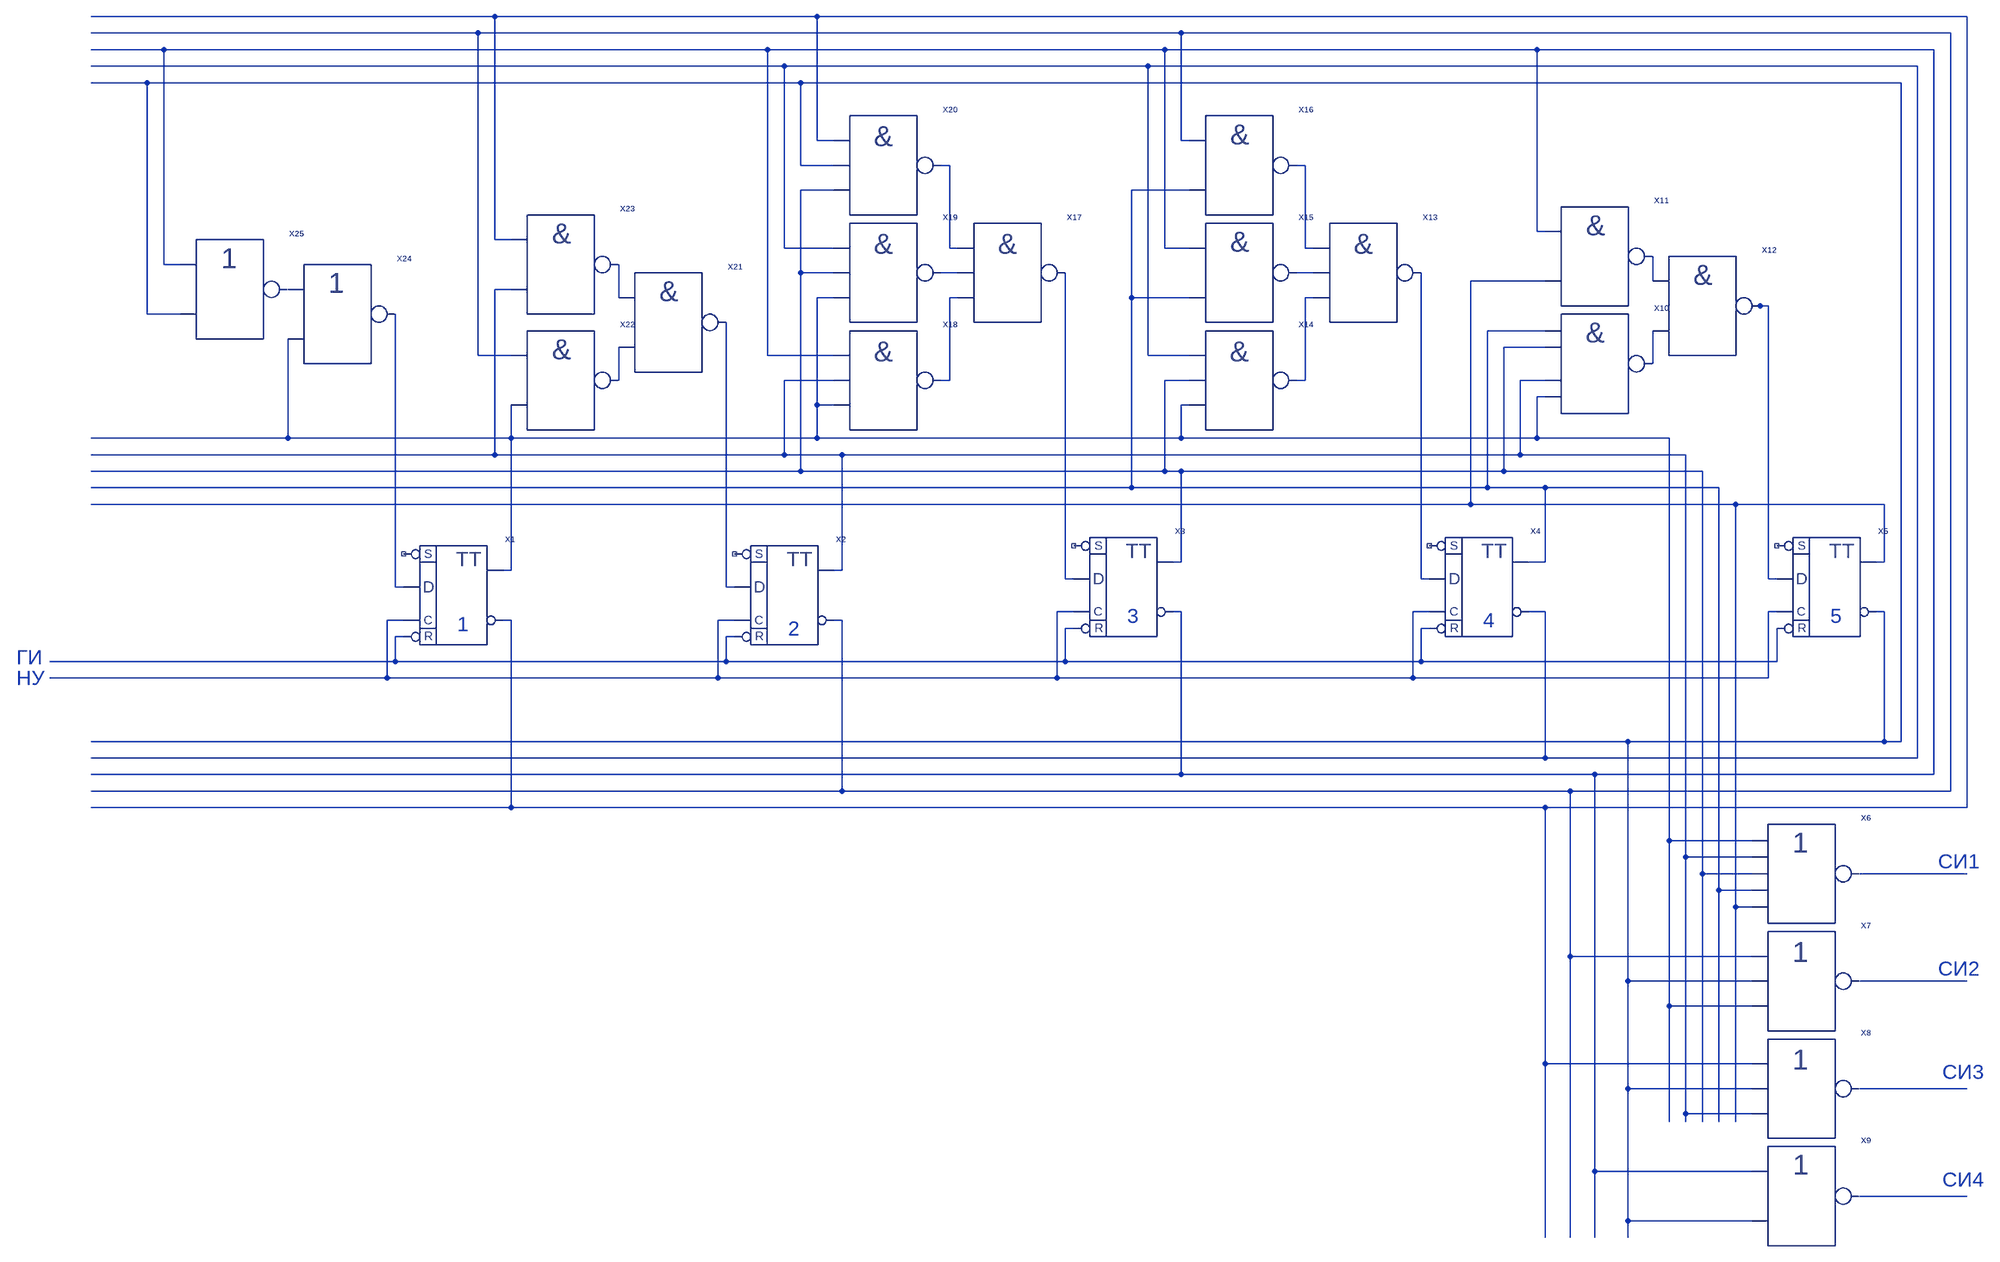
[diagram p0: schematic CounterN.asc]
CounterN.asc, the LTspice schematic file:
Version 4
SHEET 1 2772 1684
WIRE -272 -704 -1056 -704
WIRE 352 -704 -272 -704
WIRE 2576 -704 352 -704
WIRE -304 -672 -1056 -672
WIRE 1056 -672 -304 -672
WIRE 2544 -672 1056 -672
WIRE -912 -640 -1056 -640
WIRE 256 -640 -912 -640
WIRE 1024 -640 256 -640
WIRE 1744 -640 1024 -640
WIRE 2512 -640 1744 -640
WIRE 288 -608 -1056 -608
WIRE 992 -608 288 -608
WIRE 2480 -608 992 -608
WIRE -944 -576 -1056 -576
WIRE 320 -576 -944 -576
WIRE 2448 -576 320 -576
WIRE 352 -464 352 -704
WIRE 384 -464 352 -464
WIRE 1056 -464 1056 -672
WIRE 1072 -464 1056 -464
WIRE 320 -416 320 -576
WIRE 384 -416 320 -416
WIRE 608 -416 592 -416
WIRE 1296 -416 1280 -416
WIRE 384 -368 320 -368
WIRE 1072 -368 960 -368
WIRE 1744 -288 1744 -640
WIRE 1760 -288 1744 -288
WIRE -272 -272 -272 -704
WIRE -240 -272 -272 -272
WIRE 288 -256 288 -608
WIRE 384 -256 288 -256
WIRE 608 -256 608 -416
WIRE 624 -256 608 -256
WIRE 1024 -256 1024 -640
WIRE 1072 -256 1024 -256
WIRE 1296 -256 1296 -416
WIRE 1312 -256 1296 -256
WIRE -912 -224 -912 -640
WIRE -880 -224 -912 -224
WIRE 320 -208 320 -368
WIRE 384 -208 320 -208
WIRE 624 -208 592 -208
WIRE 1312 -208 1280 -208
WIRE 1760 -192 1616 -192
WIRE 1968 -192 1968 -240
WIRE -240 -176 -272 -176
WIRE -32 -160 -32 -224
WIRE 384 -160 352 -160
WIRE 624 -160 608 -160
WIRE 960 -160 960 -368
WIRE 1072 -160 960 -160
WIRE 1312 -160 1296 -160
WIRE 2176 -144 2160 -144
WIRE 2192 -144 2176 -144
WIRE -944 -128 -944 -576
WIRE -880 -128 -944 -128
WIRE 1760 -96 1648 -96
WIRE 1760 -64 1680 -64
WIRE -304 -48 -304 -672
WIRE -240 -48 -304 -48
WIRE 256 -48 256 -640
WIRE 384 -48 256 -48
WIRE 992 -48 992 -608
WIRE 1072 -48 992 -48
WIRE 1968 -32 1968 -96
WIRE -32 0 -32 -64
WIRE 384 0 288 0
WIRE 608 0 608 -160
WIRE 608 0 592 0
WIRE 1072 0 1024 0
WIRE 1296 0 1296 -160
WIRE 1296 0 1280 0
WIRE 1760 0 1712 0
WIRE 1760 32 1744 32
WIRE 352 48 352 -160
WIRE 384 48 352 48
WIRE 1072 48 1056 48
WIRE -672 112 -672 -80
WIRE -672 112 -1056 112
WIRE -240 112 -240 48
WIRE -240 112 -672 112
WIRE 352 112 352 48
WIRE 352 112 -240 112
WIRE 1056 112 1056 48
WIRE 1056 112 352 112
WIRE 1744 112 1744 32
WIRE 1744 112 1056 112
WIRE 2000 112 1744 112
WIRE -272 144 -272 -176
WIRE -272 144 -1056 144
WIRE 288 144 288 0
WIRE 288 144 -272 144
WIRE 400 144 288 144
WIRE 1712 144 1712 0
WIRE 1712 144 400 144
WIRE 2032 144 1712 144
WIRE 320 176 320 -208
WIRE 320 176 -1056 176
WIRE 1024 176 1024 0
WIRE 1024 176 320 176
WIRE 1056 176 1024 176
WIRE 1680 176 1680 -64
WIRE 1680 176 1056 176
WIRE 2064 176 1680 176
WIRE 960 208 960 -160
WIRE 960 208 -1056 208
WIRE 1648 208 1648 -96
WIRE 1648 208 960 208
WIRE 1760 208 1648 208
WIRE 2096 208 1760 208
WIRE 1616 240 1616 -192
WIRE 1616 240 -1056 240
WIRE 2128 240 1616 240
WIRE 2416 240 2128 240
WIRE 1056 352 1056 176
WIRE 1056 352 1040 352
WIRE 1760 352 1760 208
WIRE 1760 352 1728 352
WIRE 2416 352 2416 240
WIRE 2416 352 2400 352
WIRE -240 368 -240 112
WIRE -240 368 -256 368
WIRE 400 368 400 144
WIRE 400 368 384 368
WIRE 832 384 832 -208
WIRE 848 384 832 384
WIRE 1520 384 1520 -208
WIRE 1536 384 1520 384
WIRE 2192 384 2192 -144
WIRE 2208 384 2192 384
WIRE -464 400 -464 -128
WIRE -448 400 -464 400
WIRE 176 400 176 -112
WIRE 192 400 176 400
WIRE 848 448 816 448
WIRE 1056 448 1040 448
WIRE 1536 448 1504 448
WIRE 1760 448 1728 448
WIRE 2208 448 2192 448
WIRE 2416 448 2400 448
WIRE -448 464 -480 464
WIRE -240 464 -256 464
WIRE 192 464 160 464
WIRE 400 464 384 464
WIRE 848 480 832 480
WIRE 1536 480 1520 480
WIRE -448 496 -464 496
WIRE 192 496 176 496
WIRE -464 544 -464 496
WIRE -464 544 -1136 544
WIRE 176 544 176 496
WIRE 176 544 -464 544
WIRE 832 544 832 480
WIRE 832 544 176 544
WIRE 1520 544 1520 480
WIRE 1520 544 832 544
WIRE 2208 544 2208 480
WIRE 2208 544 1520 544
WIRE -480 576 -480 464
WIRE -480 576 -1136 576
WIRE 160 576 160 464
WIRE 160 576 -480 576
WIRE 816 576 816 448
WIRE 816 576 160 576
WIRE 1504 576 1504 448
WIRE 1504 576 816 576
WIRE 2192 576 2192 448
WIRE 2192 576 1504 576
WIRE 1920 704 -1056 704
WIRE 2416 704 2416 448
WIRE 2416 704 1920 704
WIRE 2448 704 2448 -576
WIRE 2448 704 2416 704
WIRE 1760 736 1760 448
WIRE 1760 736 -1056 736
WIRE 2480 736 2480 -608
WIRE 2480 736 1760 736
WIRE 1056 768 1056 448
WIRE 1056 768 -1056 768
WIRE 1856 768 1056 768
WIRE 2512 768 2512 -640
WIRE 2512 768 1856 768
WIRE 400 800 400 464
WIRE 400 800 -1056 800
WIRE 1808 800 400 800
WIRE 2544 800 2544 -672
WIRE 2544 800 1808 800
WIRE -240 832 -240 464
WIRE -240 832 -1056 832
WIRE 1760 832 -240 832
WIRE 2576 832 2576 -704
WIRE 2576 832 1760 832
WIRE 2000 896 2000 112
WIRE 2160 896 2000 896
WIRE 2032 928 2032 144
WIRE 2160 928 2032 928
WIRE 2064 960 2064 176
WIRE 2160 960 2064 960
WIRE 2576 960 2368 960
WIRE 2096 992 2096 208
WIRE 2160 992 2096 992
WIRE 2128 1024 2128 240
WIRE 2160 1024 2128 1024
WIRE 1808 1120 1808 800
WIRE 2160 1120 1808 1120
WIRE 1920 1168 1920 704
WIRE 2160 1168 1920 1168
WIRE 2576 1168 2368 1168
WIRE 2000 1216 2000 896
WIRE 2160 1216 2000 1216
WIRE 1760 1328 1760 832
WIRE 2160 1328 1760 1328
WIRE 1920 1376 1920 1168
WIRE 2160 1376 1920 1376
WIRE 2576 1376 2368 1376
WIRE 2032 1424 2032 928
WIRE 2160 1424 2032 1424
WIRE 2000 1440 2000 1216
WIRE 2032 1440 2032 1424
WIRE 2064 1440 2064 960
WIRE 2096 1440 2096 992
WIRE 2128 1440 2128 1024
WIRE 1856 1536 1856 768
WIRE 2160 1536 1856 1536
WIRE 2576 1584 2368 1584
WIRE 1920 1632 1920 1376
WIRE 2160 1632 1920 1632
WIRE 1760 1664 1760 1328
WIRE 1808 1664 1808 1120
WIRE 1856 1664 1856 1536
WIRE 1920 1664 1920 1632
SYMBOL D -352 416 R0
SYMATTR InstName X1
SYMBOL D 288 416 R0
SYMATTR InstName X2
SYMBOL D 944 400 R0
SYMATTR InstName X3
SYMBOL D 1632 400 R0
SYMATTR InstName X4
SYMBOL D 2304 400 R0
SYMATTR InstName X5
SYMBOL NOR5 2256 960 R0
SYMATTR InstName X6
SYMBOL NOR3 2256 1168 R0
SYMATTR InstName X7
SYMBOL NOR3 2256 1376 R0
SYMATTR InstName X8
SYMBOL NOR2 2256 1584 R0
SYMATTR InstName X9
SYMBOL NAND4 1856 -32 R0
SYMATTR InstName X10
SYMBOL NAND2 1856 -240 R0
SYMATTR InstName X11
SYMBOL NAND2 2064 -144 R0
SYMATTR InstName X12
SYMBOL NAND3 1408 -208 R0
SYMATTR InstName X13
SYMBOL NAND3 1168 0 R0
SYMATTR InstName X14
SYMBOL NAND2 1168 -208 R0
SYMATTR InstName X15
SYMBOL NAND2 1168 -416 R0
SYMATTR InstName X16
SYMBOL NAND3 720 -208 R0
SYMATTR InstName X17
SYMBOL NAND3 480 0 R0
SYMATTR InstName X18
SYMBOL NAND3 480 -208 R0
SYMATTR InstName X19
SYMBOL NAND3 480 -416 R0
SYMATTR InstName X20
SYMBOL NAND2 64 -112 R0
SYMATTR InstName X21
SYMBOL NAND2 -144 0 R0
SYMATTR InstName X22
SYMBOL NAND2 -144 -224 R0
SYMATTR InstName X23
SYMBOL NOR2 -576 -128 R0
SYMATTR InstName X24
SYMBOL NOR2 -784 -176 R0
SYMATTR InstName X25
TEXT -344 472 Left 4 ;1
TEXT 296 480 Left 4 ;2
TEXT 952 456 Left 4 ;3
TEXT 1640 464 Left 4 ;4
TEXT 2312 456 Left 4 ;5
TEXT 2528 1552 Left 4 ;СИ4
TEXT 2528 1344 Left 4 ;СИ3
TEXT 2520 1144 Left 4 ;СИ2
TEXT 2520 936 Left 4 ;СИ1
TEXT -1200 536 Left 4 ;ГИ
TEXT -1200 576 Left 4 ;НУ

The netlist it stands for:
* CounterN.asc
XX1 NC_01 N024 N026 N027 N016 N001 D  ; pins s d c r q nq
XX2 NC_02 N025 N026 N027 N014 N002 D  ; pins s d c r q nq
XX3 NC_03 N022 N026 N027 N008 N003 D  ; pins s d c r q nq
XX4 NC_04 N023 N026 N027 N009 N004 D  ; pins s d c r q nq
XX5 NC_05 N019 N026 N027 N012 N005 D  ; pins s d c r q nq
XX6 N016 N012 N028 N009 N014 N008 NOR5  ; pins a b o c c1 c2
XX7 N002 N016 N029 N005 NOR3  ; pins a b o c
XX8 N001 N014 N030 N005 NOR3  ; pins a b o c
XX9 N003 N005 N031 NOR2  ; pins a b o
XX10 N009 N016 N020 N014 N008 NAND4  ; pins a b o c c1
XX11 N003 N012 N013 NAND2  ; pins a b o
XX12 N013 N020 N019 NAND2  ; pins a b o
XX13 N007 N018 N023 N011 NAND3  ; pins a b o c
XX14 N004 N016 N018 N008 NAND3  ; pins a b o c
XX15 N003 N009 N011 NAND2  ; pins a b o
XX16 N002 N009 N007 NAND2  ; pins a b o
XX17 N006 N017 N022 N010 NAND3  ; pins a b o c
XX18 N003 N016 N017 N014 NAND3  ; pins a b o c
XX19 N004 N016 N010 N008 NAND3  ; pins a b o c
XX20 N001 N008 N006 N005 NAND3  ; pins a b o c
XX21 N015 N021 N025 NAND2  ; pins a b o
XX22 N002 N016 N021 NAND2  ; pins a b o
XX23 N001 N014 N015 NAND2  ; pins a b o
XX24 P001 N016 N024 NOR2  ; pins a b o
XX25 N003 N005 P001 NOR2  ; pins a b o
* 1
* 2
* 3
* 4
* 5
* СИ4
* СИ3
* СИ2
* СИ1
* ГИ
* НУ
.backanno
.end